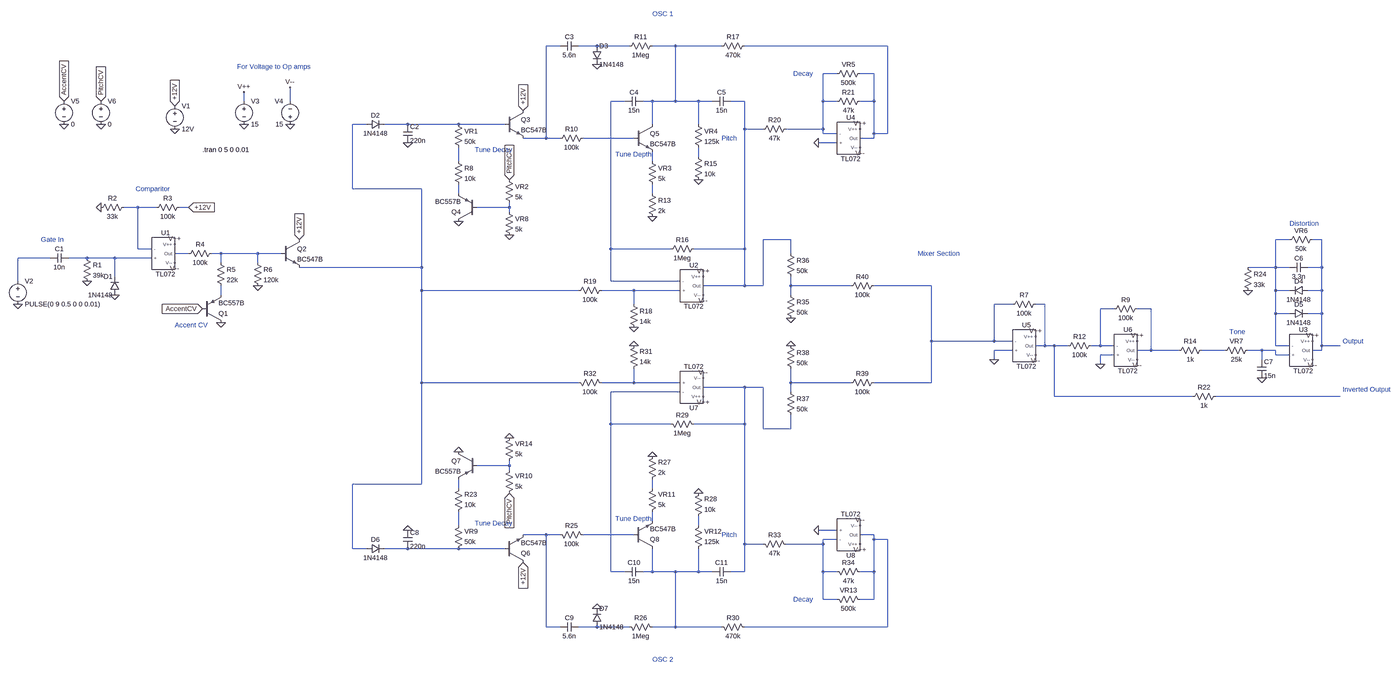
[diagram p0: schematic Kick.asc, whole sheet]
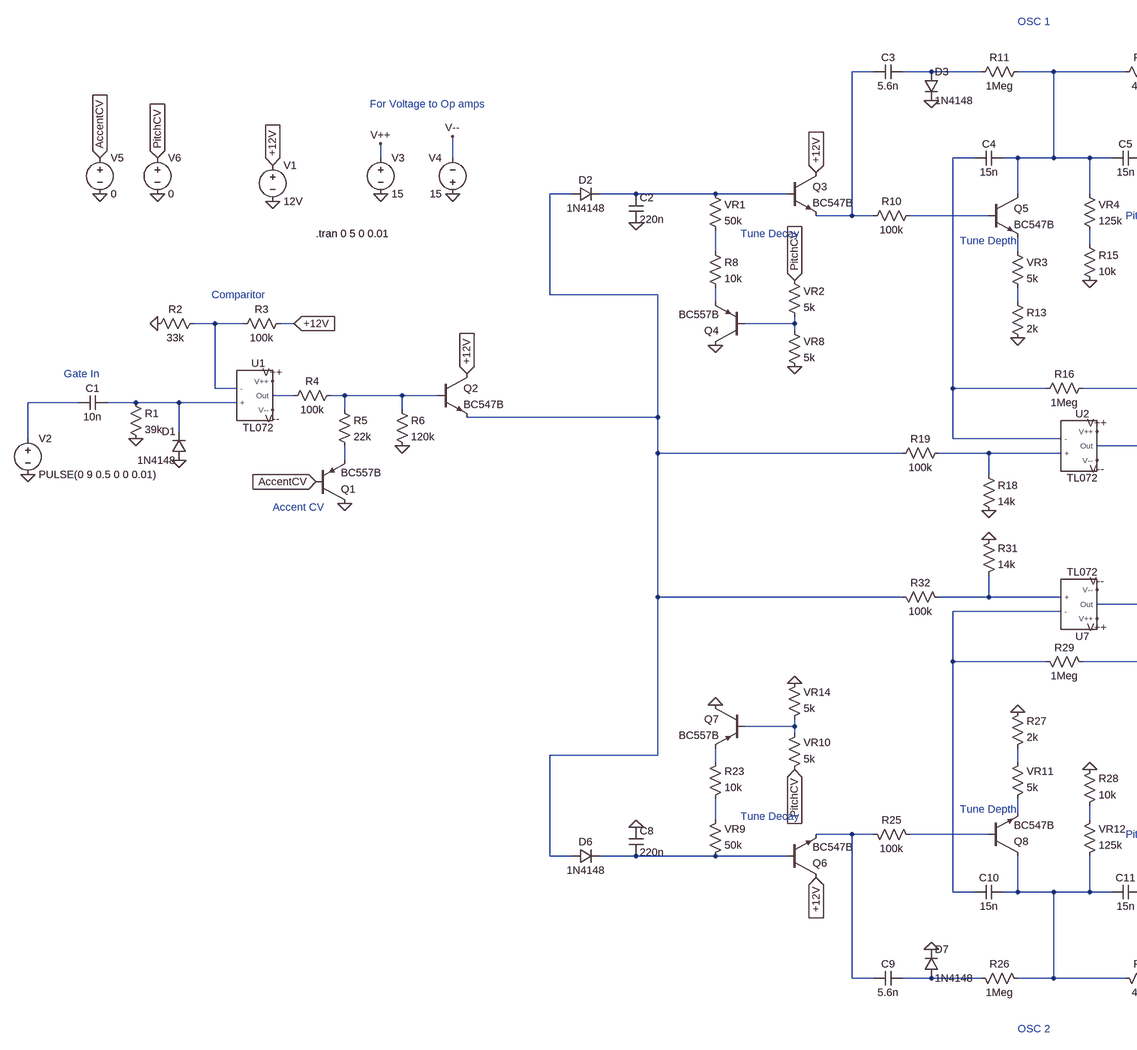
[diagram p1: schematic Kick.asc, part, row 1 of 1, column 1 of 2]
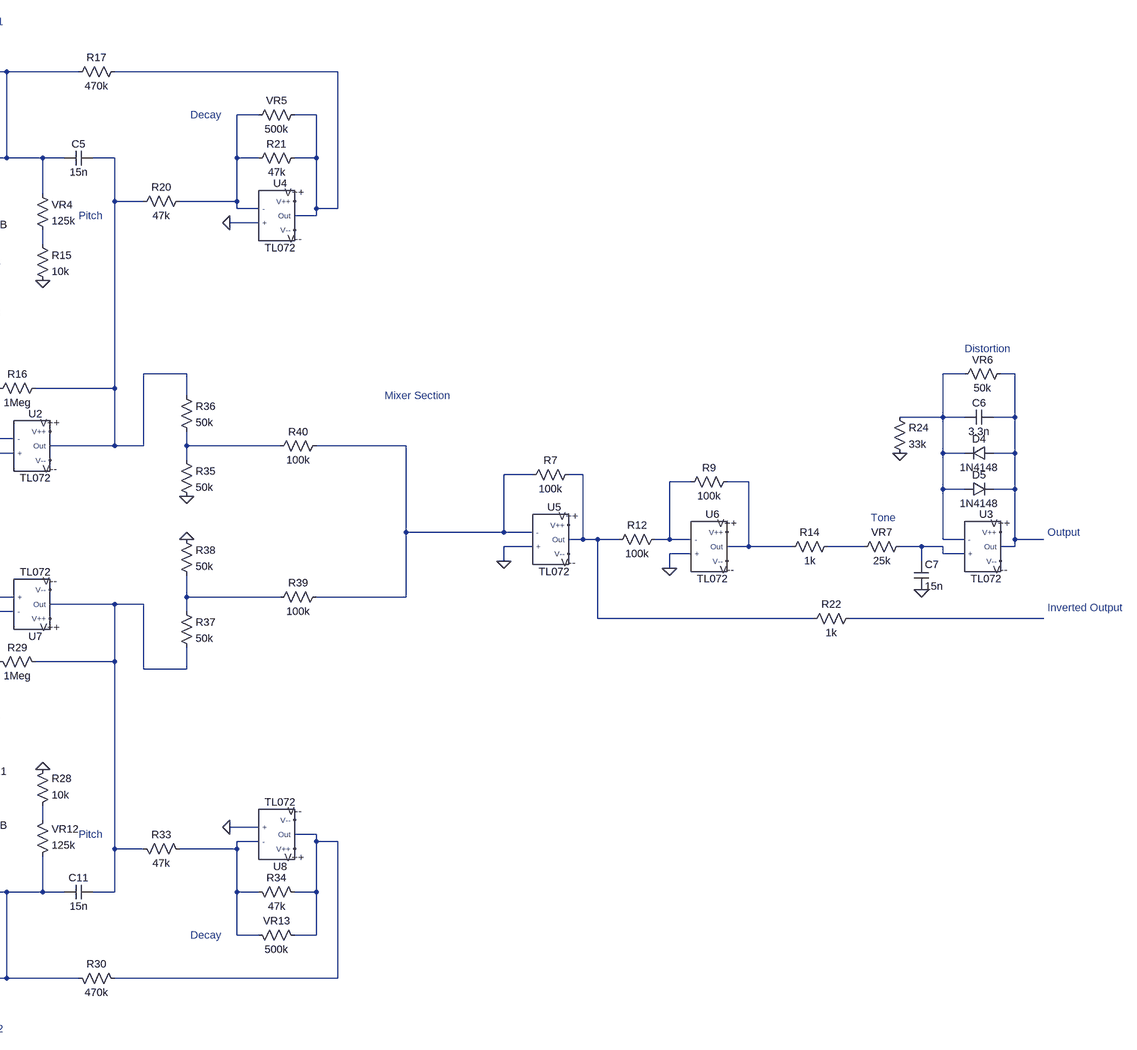
[diagram p2: schematic Kick.asc, part, row 1 of 1, column 2 of 2]
Kick.asc, the LTspice schematic file:
Version 4.1
SHEET 1 4296 1568
WIRE 1376 -576 1328 -576
WIRE 1504 -576 1440 -576
WIRE 1616 -576 1504 -576
WIRE 1776 -576 1696 -576
WIRE 1936 -576 1776 -576
WIRE 2512 -576 2016 -576
WIRE 2336 -480 2288 -480
WIRE 2464 -480 2416 -480
WIRE 240 -384 240 -416
WIRE 400 -384 400 -432
WIRE 1600 -384 1552 -384
WIRE 1696 -384 1664 -384
WIRE 1776 -384 1776 -576
WIRE 1776 -384 1696 -384
WIRE 1856 -384 1776 -384
WIRE 1904 -384 1856 -384
WIRE 2016 -384 1968 -384
WIRE 2288 -384 2288 -480
WIRE 2336 -384 2288 -384
WIRE 2464 -384 2464 -480
WIRE 2464 -384 2416 -384
WIRE 704 -304 656 -304
WIRE 848 -304 768 -304
WIRE 1024 -304 848 -304
WIRE 1184 -304 1024 -304
WIRE 1696 -304 1696 -384
WIRE 1856 -304 1856 -384
WIRE 2016 -288 2016 -384
WIRE 2080 -288 2016 -288
WIRE 2288 -288 2288 -384
WIRE 2288 -288 2160 -288
WIRE 2288 -272 2288 -288
WIRE 2336 -272 2288 -272
WIRE 2464 -272 2464 -384
WIRE 2512 -272 2512 -576
WIRE 2512 -272 2464 -272
WIRE 1328 -256 1328 -576
WIRE 1328 -256 1248 -256
WIRE 1376 -256 1328 -256
WIRE 1632 -256 1456 -256
WIRE 2464 -256 2464 -272
WIRE 2464 -256 2416 -256
WIRE 2336 -240 2272 -240
WIRE 1856 -192 1856 -224
WIRE 1024 -176 1024 -224
WIRE 1696 -176 1696 -208
WIRE 656 -80 656 -304
WIRE 896 -80 656 -80
WIRE 1024 -64 1024 -96
WIRE 1696 -64 1696 -96
WIRE -128 -16 -176 -16
WIRE -64 -16 -128 -16
WIRE 48 -16 16 -16
WIRE 1200 -16 1200 -32
WIRE 1200 -16 1088 -16
WIRE 1200 0 1200 -16
WIRE 2176 96 2080 96
WIRE 3920 96 3872 96
WIRE 4032 96 4000 96
WIRE -128 128 -128 -16
WIRE -80 128 -128 128
WIRE 1552 128 1552 -384
WIRE 1760 128 1552 128
WIRE 2016 128 2016 -288
WIRE 2016 128 1840 128
WIRE 48 144 0 144
WIRE 160 144 128 144
WIRE 288 144 160 144
WIRE 368 144 288 144
WIRE 2176 144 2176 96
WIRE -432 160 -544 160
WIRE -304 160 -368 160
WIRE -208 160 -304 160
WIRE -80 160 -208 160
WIRE 160 176 160 144
WIRE 288 176 288 144
WIRE 896 192 896 -80
WIRE 896 192 432 192
WIRE 3872 192 3872 96
WIRE 3872 192 3776 192
WIRE 3920 192 3872 192
WIRE 4032 192 4032 96
WIRE 4032 192 3984 192
WIRE -208 224 -208 160
WIRE -544 240 -544 160
WIRE 1552 240 1552 128
WIRE 1792 240 1552 240
WIRE 2016 256 2016 128
WIRE 2016 256 1872 256
WIRE 2080 256 2080 96
WIRE 2080 256 2016 256
WIRE 2176 256 2176 224
WIRE 2384 256 2176 256
WIRE 2672 256 2464 256
WIRE 896 272 896 192
WIRE 1440 272 896 272
WIRE 1632 272 1520 272
WIRE 1792 272 1632 272
WIRE 3872 272 3872 192
WIRE 3920 272 3872 272
WIRE 4032 272 4032 192
WIRE 4032 272 3984 272
WIRE 160 288 160 256
WIRE 2176 288 2176 256
WIRE 1632 320 1632 272
WIRE 2960 320 2896 320
WIRE 3072 320 3040 320
WIRE 3312 336 3264 336
WIRE 3440 336 3392 336
WIRE 3872 352 3872 272
WIRE 3920 352 3872 352
WIRE 4032 352 4032 272
WIRE 4032 352 3984 352
WIRE 2672 448 2672 256
WIRE 2896 448 2896 320
WIRE 2896 448 2672 448
WIRE 2960 448 2896 448
WIRE 3072 464 3072 320
WIRE 3072 464 3040 464
WIRE 3104 464 3072 464
WIRE 3152 464 3104 464
WIRE 3264 464 3264 336
WIRE 3264 464 3232 464
WIRE 3312 464 3264 464
WIRE 3872 464 3872 352
WIRE 3920 464 3872 464
WIRE 4032 464 4032 352
WIRE 4096 464 4032 464
WIRE 2960 480 2896 480
WIRE 3440 480 3440 336
WIRE 3440 480 3392 480
WIRE 3536 480 3440 480
WIRE 3696 480 3616 480
WIRE 3824 480 3776 480
WIRE 3872 480 3824 480
WIRE 4032 480 4032 464
WIRE 4032 480 4000 480
WIRE 3312 496 3264 496
WIRE 3872 496 3872 480
WIRE 3920 496 3872 496
WIRE 2896 512 2896 480
WIRE 3824 512 3824 480
WIRE 3264 528 3264 496
WIRE 896 592 896 272
WIRE 1440 592 896 592
WIRE 1632 592 1632 544
WIRE 1632 592 1520 592
WIRE 1792 592 1632 592
WIRE 2176 592 2176 544
WIRE 2384 592 2176 592
WIRE 2672 592 2672 448
WIRE 2672 592 2464 592
WIRE 2016 608 1872 608
WIRE 2080 608 2016 608
WIRE 1792 624 1552 624
WIRE 2176 624 2176 592
WIRE 3104 640 3104 464
WIRE 3584 640 3104 640
WIRE 4096 640 3664 640
WIRE 1552 736 1552 624
WIRE 1760 736 1552 736
WIRE 2016 736 2016 608
WIRE 2016 736 1840 736
WIRE 2080 752 2080 608
WIRE 2176 752 2176 704
WIRE 2176 752 2080 752
WIRE 1200 880 1200 864
WIRE 1200 880 1088 880
WIRE 1200 896 1200 880
WIRE 896 944 896 592
WIRE 896 944 656 944
WIRE 1024 960 1024 928
WIRE 1696 960 1696 928
WIRE 1696 1072 1696 1040
WIRE 1024 1088 1024 1040
WIRE 1856 1088 1856 1056
WIRE 2336 1104 2272 1104
WIRE 1328 1120 1248 1120
WIRE 1376 1120 1328 1120
WIRE 1632 1120 1456 1120
WIRE 2464 1120 2416 1120
WIRE 2336 1136 2288 1136
WIRE 2464 1136 2464 1120
WIRE 2512 1136 2464 1136
WIRE 2016 1152 2016 736
WIRE 2080 1152 2016 1152
WIRE 2288 1152 2288 1136
WIRE 2288 1152 2160 1152
WIRE 656 1168 656 944
WIRE 704 1168 656 1168
WIRE 848 1168 768 1168
WIRE 1024 1168 848 1168
WIRE 1184 1168 1024 1168
WIRE 1552 1248 1552 736
WIRE 1600 1248 1552 1248
WIRE 1696 1248 1696 1168
WIRE 1696 1248 1664 1248
WIRE 1776 1248 1696 1248
WIRE 1856 1248 1856 1168
WIRE 1856 1248 1776 1248
WIRE 1904 1248 1856 1248
WIRE 2016 1248 2016 1152
WIRE 2016 1248 1968 1248
WIRE 2288 1248 2288 1152
WIRE 2336 1248 2288 1248
WIRE 2464 1248 2464 1136
WIRE 2464 1248 2416 1248
WIRE 2288 1344 2288 1248
WIRE 2336 1344 2288 1344
WIRE 2464 1344 2464 1248
WIRE 2464 1344 2416 1344
WIRE 1328 1440 1328 1120
WIRE 1376 1440 1328 1440
WIRE 1504 1440 1440 1440
WIRE 1616 1440 1504 1440
WIRE 1776 1440 1776 1248
WIRE 1776 1440 1696 1440
WIRE 1936 1440 1776 1440
WIRE 2512 1440 2512 1136
WIRE 2512 1440 2016 1440
FLAG -304 240 0
FLAG -208 288 0
FLAG -256 -16 0
FLAG 288 256 0
FLAG 160 384 0
FLAG 1024 32 0
FLAG 848 -240 0
FLAG 1504 -512 0
FLAG 1696 16 0
FLAG 1856 -112 0
FLAG 1632 400 0
FLAG 3776 272 0
FLAG 3824 576 0
FLAG 48 -16 +12V
IOPIN 48 -16 In
FLAG 432 96 +12V
IOPIN 432 96 In
FLAG 1248 -352 +12V
IOPIN 1248 -352 In
FLAG 0 -288 0
FLAG 0 -368 +12V
IOPIN 0 -368 In
FLAG 96 336 AccentCV
IOPIN 96 336 In
FLAG -544 320 0
FLAG 240 -416 V++
FLAG 240 -304 0
FLAG 400 -304 0
FLAG 400 -432 V--
FLAG -384 -304 0
FLAG -384 -384 AccentCV
IOPIN -384 -384 In
FLAG 1200 -112 PitchCV
IOPIN 1200 -112 In
FLAG -256 -384 PitchCV
IOPIN -256 -384 In
FLAG -256 -304 0
FLAG 2272 -240 0
FLAG 0 112 V++
FLAG 0 176 V--
FLAG 1872 224 V++
FLAG 1872 288 V--
FLAG 4000 448 V++
FLAG 2416 -288 V++
FLAG 4000 512 V--
FLAG 2416 -224 V--
FLAG 1200 80 0
FLAG 3040 496 V--
FLAG 3392 512 V--
FLAG 3040 432 V++
FLAG 3392 448 V++
FLAG 3264 528 0
FLAG 2896 512 0
FLAG 1024 832 0
FLAG 848 1104 0
FLAG 1504 1376 0
FLAG 1696 848 0
FLAG 1856 976 0
FLAG 1632 464 0
FLAG 1248 1216 +12V
IOPIN 1248 1216 In
FLAG 1200 976 PitchCV
IOPIN 1200 976 In
FLAG 2272 1104 0
FLAG 1872 640 V++
FLAG 1872 576 V--
FLAG 2416 1152 V++
FLAG 2416 1088 V--
FLAG 1200 784 0
FLAG 2176 464 0
FLAG 2176 368 0
SYMBOL cap -432 176 R270
WINDOW 0 32 32 VTop 2
WINDOW 3 0 32 VBottom 2
SYMATTR InstName C1
SYMATTR Value 10n
SYMBOL res -320 144 R0
SYMATTR InstName R1
SYMATTR Value 39k
SYMBOL diode -192 288 R180
WINDOW 0 24 64 Left 2
WINDOW 3 24 0 Left 2
SYMATTR InstName D1
SYMATTR Value 1N4148
SYMBOL res -160 -32 R90
WINDOW 0 0 56 VBottom 2
WINDOW 3 32 56 VTop 2
SYMATTR InstName R2
SYMATTR Value 33k
SYMBOL res 32 -32 R90
WINDOW 0 0 56 VBottom 2
WINDOW 3 32 56 VTop 2
SYMATTR InstName R3
SYMATTR Value 100k
SYMBOL res 32 160 R270
WINDOW 0 32 56 VTop 2
WINDOW 3 0 56 VBottom 2
SYMATTR InstName R4
SYMATTR Value 100k
SYMBOL res 144 160 R0
SYMATTR InstName R5
SYMATTR Value 22k
SYMBOL res 272 160 R0
SYMATTR InstName R6
SYMATTR Value 120k
SYMBOL pnp 96 384 M180
SYMATTR InstName Q1
SYMATTR Value BC557B
SYMBOL npn 368 96 R0
SYMATTR InstName Q2
SYMATTR Value BC547B
SYMBOL diode 704 -288 R270
WINDOW 0 32 32 VTop 2
WINDOW 3 0 32 VBottom 2
SYMATTR InstName D2
SYMATTR Value 1N4148
SYMBOL cap 832 -304 R0
SYMATTR InstName C2
SYMATTR Value 220n
SYMBOL res 1008 -320 R0
SYMATTR InstName VR1
SYMATTR Value 50k
SYMBOL res 1008 -192 R0
SYMATTR InstName R8
SYMATTR Value 10k
SYMBOL npn 1184 -352 R0
SYMATTR InstName Q3
SYMATTR Value BC547B
SYMBOL pnp 1088 32 R180
SYMATTR InstName Q4
SYMATTR Value BC557B
SYMBOL res 1184 -128 R0
SYMATTR InstName VR2
SYMATTR Value 5k
SYMBOL res 1360 -240 R270
WINDOW 0 32 56 VTop 2
WINDOW 3 0 56 VBottom 2
SYMATTR InstName R10
SYMATTR Value 100k
SYMBOL cap 1376 -560 R270
WINDOW 0 32 32 VTop 2
WINDOW 3 0 32 VBottom 2
SYMATTR InstName C3
SYMATTR Value 5.6n
SYMBOL diode 1488 -576 R0
SYMATTR InstName D3
SYMATTR Value 1N4148
SYMBOL res 1600 -560 R270
WINDOW 0 32 56 VTop 2
WINDOW 3 0 56 VBottom 2
SYMATTR InstName R11
SYMATTR Value 1Meg
SYMBOL cap 1664 -400 R90
WINDOW 0 0 32 VBottom 2
WINDOW 3 32 32 VTop 2
SYMATTR InstName C4
SYMATTR Value 15n
SYMBOL cap 1904 -368 R270
WINDOW 0 32 32 VTop 2
WINDOW 3 0 32 VBottom 2
SYMATTR InstName C5
SYMATTR Value 15n
SYMBOL npn 1632 -304 R0
SYMATTR InstName Q5
SYMATTR Value BC547B
SYMBOL res 1680 -192 R0
SYMATTR InstName VR3
SYMATTR Value 5k
SYMBOL res 1680 -80 R0
SYMATTR InstName R13
SYMATTR Value 2k
SYMBOL res 1840 -320 R0
SYMATTR InstName VR4
SYMATTR Value 125k
SYMBOL res 1840 -208 R0
SYMATTR InstName R15
SYMATTR Value 10k
SYMBOL res 1856 112 R90
WINDOW 0 0 56 VBottom 2
WINDOW 3 32 56 VTop 2
SYMATTR InstName R16
SYMATTR Value 1Meg
SYMBOL res 1920 -560 R270
WINDOW 0 32 56 VTop 2
WINDOW 3 0 56 VBottom 2
SYMATTR InstName R17
SYMATTR Value 470k
SYMBOL res 1616 304 R0
SYMATTR InstName R18
SYMATTR Value 14k
SYMBOL res 1424 288 R270
WINDOW 0 32 56 VTop 2
WINDOW 3 0 56 VBottom 2
SYMATTR InstName R19
SYMATTR Value 100k
SYMBOL res 2176 -304 R90
WINDOW 0 0 56 VBottom 2
WINDOW 3 32 56 VTop 2
SYMATTR InstName R20
SYMATTR Value 47k
SYMBOL res 2432 -400 R90
WINDOW 0 0 56 VBottom 2
WINDOW 3 32 56 VTop 2
SYMATTR InstName R21
SYMATTR Value 47k
SYMBOL res 2432 -496 R90
WINDOW 0 0 56 VBottom 2
WINDOW 3 32 56 VTop 2
SYMATTR InstName VR5
SYMATTR Value 500k
SYMBOL res 4016 80 R90
WINDOW 0 0 56 VBottom 2
WINDOW 3 32 56 VTop 2
SYMATTR InstName VR6
SYMATTR Value 50k
SYMBOL cap 3984 176 R90
WINDOW 0 0 32 VBottom 2
WINDOW 3 32 32 VTop 2
SYMATTR InstName C6
SYMATTR Value 3.3n
SYMBOL diode 3984 256 R90
WINDOW 0 0 32 VBottom 2
WINDOW 3 32 32 VTop 2
SYMATTR InstName D4
SYMATTR Value 1N4148
SYMBOL diode 3920 368 R270
WINDOW 0 32 32 VTop 2
WINDOW 3 0 32 VBottom 2
SYMATTR InstName D5
SYMATTR Value 1N4148
SYMBOL res 3760 176 R0
SYMATTR InstName R24
SYMATTR Value 33k
SYMBOL res 3680 496 R270
WINDOW 0 32 56 VTop 2
WINDOW 3 0 56 VBottom 2
SYMATTR InstName VR7
SYMATTR Value 25k
SYMBOL cap 3808 512 R0
SYMATTR InstName C7
SYMATTR Value 15n
SYMBOL voltage 0 -384 R0
SYMATTR InstName V1
SYMATTR Value 12V
SYMBOL voltage -544 224 R0
WINDOW 123 0 0 Left 0
WINDOW 39 0 0 Left 0
SYMATTR InstName V2
SYMATTR Value PULSE(0 9 0.5 0 0 0.01)
SYMBOL voltage 240 -400 R0
WINDOW 123 0 0 Left 0
WINDOW 39 0 0 Left 0
SYMATTR InstName V3
SYMATTR Value 15
SYMBOL voltage 400 -288 R180
WINDOW 0 24 96 Left 2
WINDOW 3 24 16 Left 2
SYMATTR InstName V4
SYMATTR Value 15
SYMBOL voltage -384 -400 R0
SYMATTR InstName V5
SYMATTR Value 0
SYMBOL voltage -256 -400 R0
SYMATTR InstName V6
SYMATTR Value 0
SYMBOL TL072 -32 144 R0
SYMATTR InstName U1
SYMBOL TL072 1840 256 R0
SYMATTR InstName U2
SYMBOL TL072 3968 480 R0
SYMATTR InstName U3
SYMBOL TL072 2384 -256 R0
SYMATTR InstName U4
SYMBOL res 1184 -16 R0
SYMATTR InstName VR8
SYMATTR Value 5k
SYMBOL TL072 3008 464 R0
SYMATTR InstName U5
SYMBOL TL072 3360 480 R0
SYMATTR InstName U6
SYMBOL res 3056 304 R90
WINDOW 0 0 56 VBottom 2
WINDOW 3 32 56 VTop 2
SYMATTR InstName R7
SYMATTR Value 100k
SYMBOL res 3408 320 R90
WINDOW 0 0 56 VBottom 2
WINDOW 3 32 56 VTop 2
SYMATTR InstName R9
SYMATTR Value 100k
SYMBOL res 3248 448 R90
WINDOW 0 0 56 VBottom 2
WINDOW 3 32 56 VTop 2
SYMATTR InstName R12
SYMATTR Value 100k
SYMBOL res 3632 464 R90
WINDOW 0 0 56 VBottom 2
WINDOW 3 32 56 VTop 2
SYMATTR InstName R14
SYMATTR Value 1k
SYMBOL res 3680 624 R90
WINDOW 0 0 56 VBottom 2
WINDOW 3 32 56 VTop 2
SYMATTR InstName R22
SYMATTR Value 1k
SYMBOL diode 704 1152 M90
WINDOW 0 0 32 VBottom 2
WINDOW 3 32 32 VTop 2
SYMATTR InstName D6
SYMATTR Value 1N4148
SYMBOL cap 832 1168 M180
WINDOW 0 24 56 Left 2
WINDOW 3 24 8 Left 2
SYMATTR InstName C8
SYMATTR Value 220n
SYMBOL res 1008 1184 M180
WINDOW 0 36 76 Left 2
WINDOW 3 36 40 Left 2
SYMATTR InstName VR9
SYMATTR Value 50k
SYMBOL res 1008 1056 M180
WINDOW 0 36 76 Left 2
WINDOW 3 36 40 Left 2
SYMATTR InstName R23
SYMATTR Value 10k
SYMBOL npn 1184 1216 M180
SYMATTR InstName Q6
SYMATTR Value BC547B
SYMBOL pnp 1088 832 M0
SYMATTR InstName Q7
SYMATTR Value BC557B
SYMBOL res 1184 992 M180
WINDOW 0 36 76 Left 2
WINDOW 3 36 40 Left 2
SYMATTR InstName VR10
SYMATTR Value 5k
SYMBOL res 1360 1104 M90
WINDOW 0 0 56 VBottom 2
WINDOW 3 32 56 VTop 2
SYMATTR InstName R25
SYMATTR Value 100k
SYMBOL cap 1376 1424 M90
WINDOW 0 0 32 VBottom 2
WINDOW 3 32 32 VTop 2
SYMATTR InstName C9
SYMATTR Value 5.6n
SYMBOL diode 1488 1440 M180
WINDOW 0 24 64 Left 2
WINDOW 3 24 0 Left 2
SYMATTR InstName D7
SYMATTR Value 1N4148
SYMBOL res 1600 1424 M90
WINDOW 0 0 56 VBottom 2
WINDOW 3 32 56 VTop 2
SYMATTR InstName R26
SYMATTR Value 1Meg
SYMBOL cap 1664 1264 M270
WINDOW 0 32 32 VTop 2
WINDOW 3 0 32 VBottom 2
SYMATTR InstName C10
SYMATTR Value 15n
SYMBOL cap 1904 1232 M90
WINDOW 0 0 32 VBottom 2
WINDOW 3 32 32 VTop 2
SYMATTR InstName C11
SYMATTR Value 15n
SYMBOL npn 1632 1168 M180
SYMATTR InstName Q8
SYMATTR Value BC547B
SYMBOL res 1680 1056 M180
WINDOW 0 36 76 Left 2
WINDOW 3 36 40 Left 2
SYMATTR InstName VR11
SYMATTR Value 5k
SYMBOL res 1680 944 M180
WINDOW 0 36 76 Left 2
WINDOW 3 36 40 Left 2
SYMATTR InstName R27
SYMATTR Value 2k
SYMBOL res 1840 1184 M180
WINDOW 0 36 76 Left 2
WINDOW 3 36 40 Left 2
SYMATTR InstName VR12
SYMATTR Value 125k
SYMBOL res 1840 1072 M180
WINDOW 0 36 76 Left 2
WINDOW 3 36 40 Left 2
SYMATTR InstName R28
SYMATTR Value 10k
SYMBOL res 1856 752 M270
WINDOW 0 32 56 VTop 2
WINDOW 3 0 56 VBottom 2
SYMATTR InstName R29
SYMATTR Value 1Meg
SYMBOL res 1920 1424 M90
WINDOW 0 0 56 VBottom 2
WINDOW 3 32 56 VTop 2
SYMATTR InstName R30
SYMATTR Value 470k
SYMBOL res 1616 560 M180
WINDOW 0 36 76 Left 2
WINDOW 3 36 40 Left 2
SYMATTR InstName R31
SYMATTR Value 14k
SYMBOL res 1424 576 M90
WINDOW 0 0 56 VBottom 2
WINDOW 3 32 56 VTop 2
SYMATTR InstName R32
SYMATTR Value 100k
SYMBOL res 2176 1168 M270
WINDOW 0 32 56 VTop 2
WINDOW 3 0 56 VBottom 2
SYMATTR InstName R33
SYMATTR Value 47k
SYMBOL res 2432 1264 M270
WINDOW 0 32 56 VTop 2
WINDOW 3 0 56 VBottom 2
SYMATTR InstName R34
SYMATTR Value 47k
SYMBOL res 2432 1360 M270
WINDOW 0 32 56 VTop 2
WINDOW 3 0 56 VBottom 2
SYMATTR InstName VR13
SYMATTR Value 500k
SYMBOL TL072 1840 608 M180
SYMATTR InstName U7
SYMBOL TL072 2384 1120 M180
SYMATTR InstName U8
SYMBOL res 1184 880 M180
WINDOW 0 36 76 Left 2
WINDOW 3 36 40 Left 2
SYMATTR InstName VR14
SYMATTR Value 5k
SYMBOL res 2160 272 R0
SYMATTR InstName R35
SYMATTR Value 50k
SYMBOL res 2160 128 R0
SYMATTR InstName R36
SYMATTR Value 50k
SYMBOL res 2160 608 R0
SYMATTR InstName R37
SYMATTR Value 50k
SYMBOL res 2160 448 R0
SYMATTR InstName R38
SYMATTR Value 50k
SYMBOL res 2480 576 R90
WINDOW 0 0 56 VBottom 2
WINDOW 3 32 56 VTop 2
SYMATTR InstName R39
SYMATTR Value 100k
SYMBOL res 2480 240 R90
WINDOW 0 0 56 VBottom 2
WINDOW 3 32 56 VTop 2
SYMATTR InstName R40
SYMATTR Value 100k
TEXT 3712 416 Left 2 ;Tone
TEXT 3920 40 Left 2 ;Distortion
TEXT 2184 -480 Left 2 ;Decay
TEXT 1080 -216 Left 2 ;Tune Decay
TEXT 1568 -200 Left 2 ;Tune Depth
TEXT 1936 -256 Left 2 ;Pitch
TEXT 0 392 Left 2 ;Accent CV
TEXT -464 96 Left 2 ;Gate In
TEXT 96 -216 Left 2 !.tran 0 5 0 0.01
TEXT 4104 448 Left 2 ;Output
TEXT 216 -504 Left 2 ;For Voltage to Op amps
TEXT 4104 616 Left 2 ;Inverted Output
TEXT 2624 144 Left 2 ;Mixer Section
TEXT 1696 -688 Left 2 ;OSC 1
TEXT -136 -80 Left 2 ;Comparitor
TEXT 2184 1344 Left 2 ;Decay
TEXT 1080 1080 Left 2 ;Tune Decay
TEXT 1568 1064 Left 2 ;Tune Depth
TEXT 1936 1120 Left 2 ;Pitch
TEXT 1696 1552 Left 2 ;OSC 2

The netlist it stands for:
* Kick.asc
C1 N022 N023 10n
R1 N023 0 39k
D1 0 N023 1N4148
R2 N016 0 33k
R3 +12V N016 100k
R4 N020 N021 100k
R5 N021 N027 22k
R6 N021 0 120k
Q1 0 AccentCV N027 0 BC557B
Q2 +12V N021 N008 0 BC547B
D2 N008 N009 1N4148
C2 N009 0 220n
R§VR1 N009 N012 50k
R8 N012 N014 10k
Q3 +12V N009 N001 0 BC547B
Q4 0 N017 N014 0 BC557B
R§VR2 PitchCV N017 5k
R10 N001 N010 100k
C3 N001 N002 5.6n
D3 N002 0 1N4148
R11 N002 N003 1Meg
C4 N003 N006 15n
C5 N003 N007 15n
Q5 N003 N010 N013 0 BC547B
R§VR3 N013 N015 5k
R13 N015 0 2k
R§VR4 N003 N011 125k
R15 N011 0 10k
R16 N007 N006 1Meg
R17 N003 N004 470k
R18 N026 0 14k
R19 N008 N026 100k
R20 N005 N007 47k
R21 N004 N005 47k
R§VR5 N004 N005 500k
R§VR6 N019 N018 50k
C6 N019 N018 3.3n
D4 N019 N018 1N4148
D5 N018 N019 1N4148
R24 N018 0 33k
R§VR7 N031 N032 25k
C7 N032 0 15n
V1 +12V 0 12V
V2 N022 0 PULSE(0 9 0.5 0 0 0.01)
V3 V++ 0 15
V4 0 V-- 15
V5 AccentCV 0 0
V6 PitchCV 0 0
X§U1 N023 N016 V++ V-- N020 TL072  ; pins + - V++ V-- Out
X§U2 N026 N006 V++ V-- N007 TL072  ; pins + - V++ V-- Out
X§U3 N032 N018 V++ V-- N019 TL072  ; pins + - V++ V-- Out
X§U4 0 N005 V++ V-- N004 TL072  ; pins + - V++ V-- Out
R§VR8 N017 0 5k
X§U5 0 N025 V++ V-- N028 TL072  ; pins + - V++ V-- Out
X§U6 0 N029 V++ V-- N030 TL072  ; pins + - V++ V-- Out
R7 N028 N025 100k
R9 N030 N029 100k
R12 N029 N028 100k
R14 N031 N030 1k
R22 N037 N028 1k
D6 N008 N048 1N4148
C8 N048 0 220n
R§VR9 N048 N042 50k
R23 N042 N039 10k
Q6 +12V N048 N044 0 BC547B
Q7 0 N038 N039 0 BC557B
R§VR10 PitchCV N038 5k
R25 N044 N045 100k
C9 N044 N050 5.6n
D7 N050 0 1N4148
R26 N050 N049 1Meg
C10 N049 N036 15n
C11 N049 N035 15n
Q8 N049 N045 N041 0 BC547B
R§VR11 N041 N040 5k
R27 N040 0 2k
R§VR12 N049 N043 125k
R28 N043 0 10k
R29 N035 N036 1Meg
R30 N049 N046 470k
R31 N033 0 14k
R32 N008 N033 100k
R33 N047 N035 47k
R34 N046 N047 47k
R§VR13 N046 N047 500k
X§U7 N033 N036 V++ V-- N035 TL072  ; pins + - V++ V-- Out
X§U8 0 N047 V++ V-- N046 TL072  ; pins + - V++ V-- Out
R§VR14 N038 0 5k
R35 N024 0 50k
R36 N007 N024 50k
R37 N034 N035 50k
R38 0 N034 50k
R39 N025 N034 100k
R40 N025 N024 100k
.model D D
.lib standard.dio
.model NPN NPN
.model PNP PNP
.lib standard.bjt
* Tone
* Distortion
* Decay
* Tune Decay
* Tune Depth
* Pitch
* Accent CV
* Gate In
.tran 0 5 0 0.01
* Output
* For Voltage to Op amps
* Inverted Output
* Mixer Section
* OSC 1
* Comparitor
* Decay
* Tune Decay
* Tune Depth
* Pitch
* OSC 2
.lib C:\Users\colli\Desktop\EE\Synth\LTKick\TL072.301
.backanno
.end